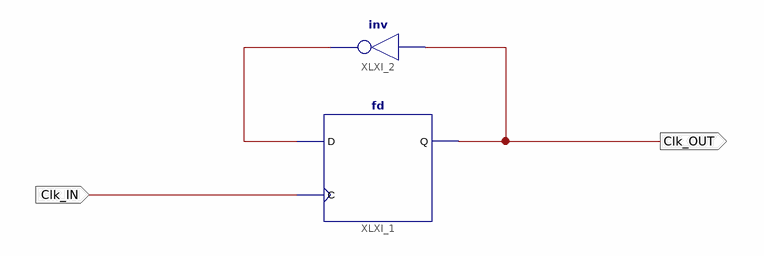
[diagram p0: schematic sheet 1]
// Xilinx ISE schematic div2.sch (spartan6) as structural Verilog: 2 symbols, 2 ports
module div2 (
  input  Clk_IN,
  output Clk_OUT
);

  wire XLXN_4;

  fd XLXI_1 (.C(Clk_IN), .D(XLXN_4), .Q(Clk_OUT));
  not XLXI_2 (XLXN_4, Clk_OUT);
endmodule
